# Altium schematic sheet Remie_Schematic.SchDoc (part 1 of 3)
size A2; SheetNumber: 1; SheetTotal: 1
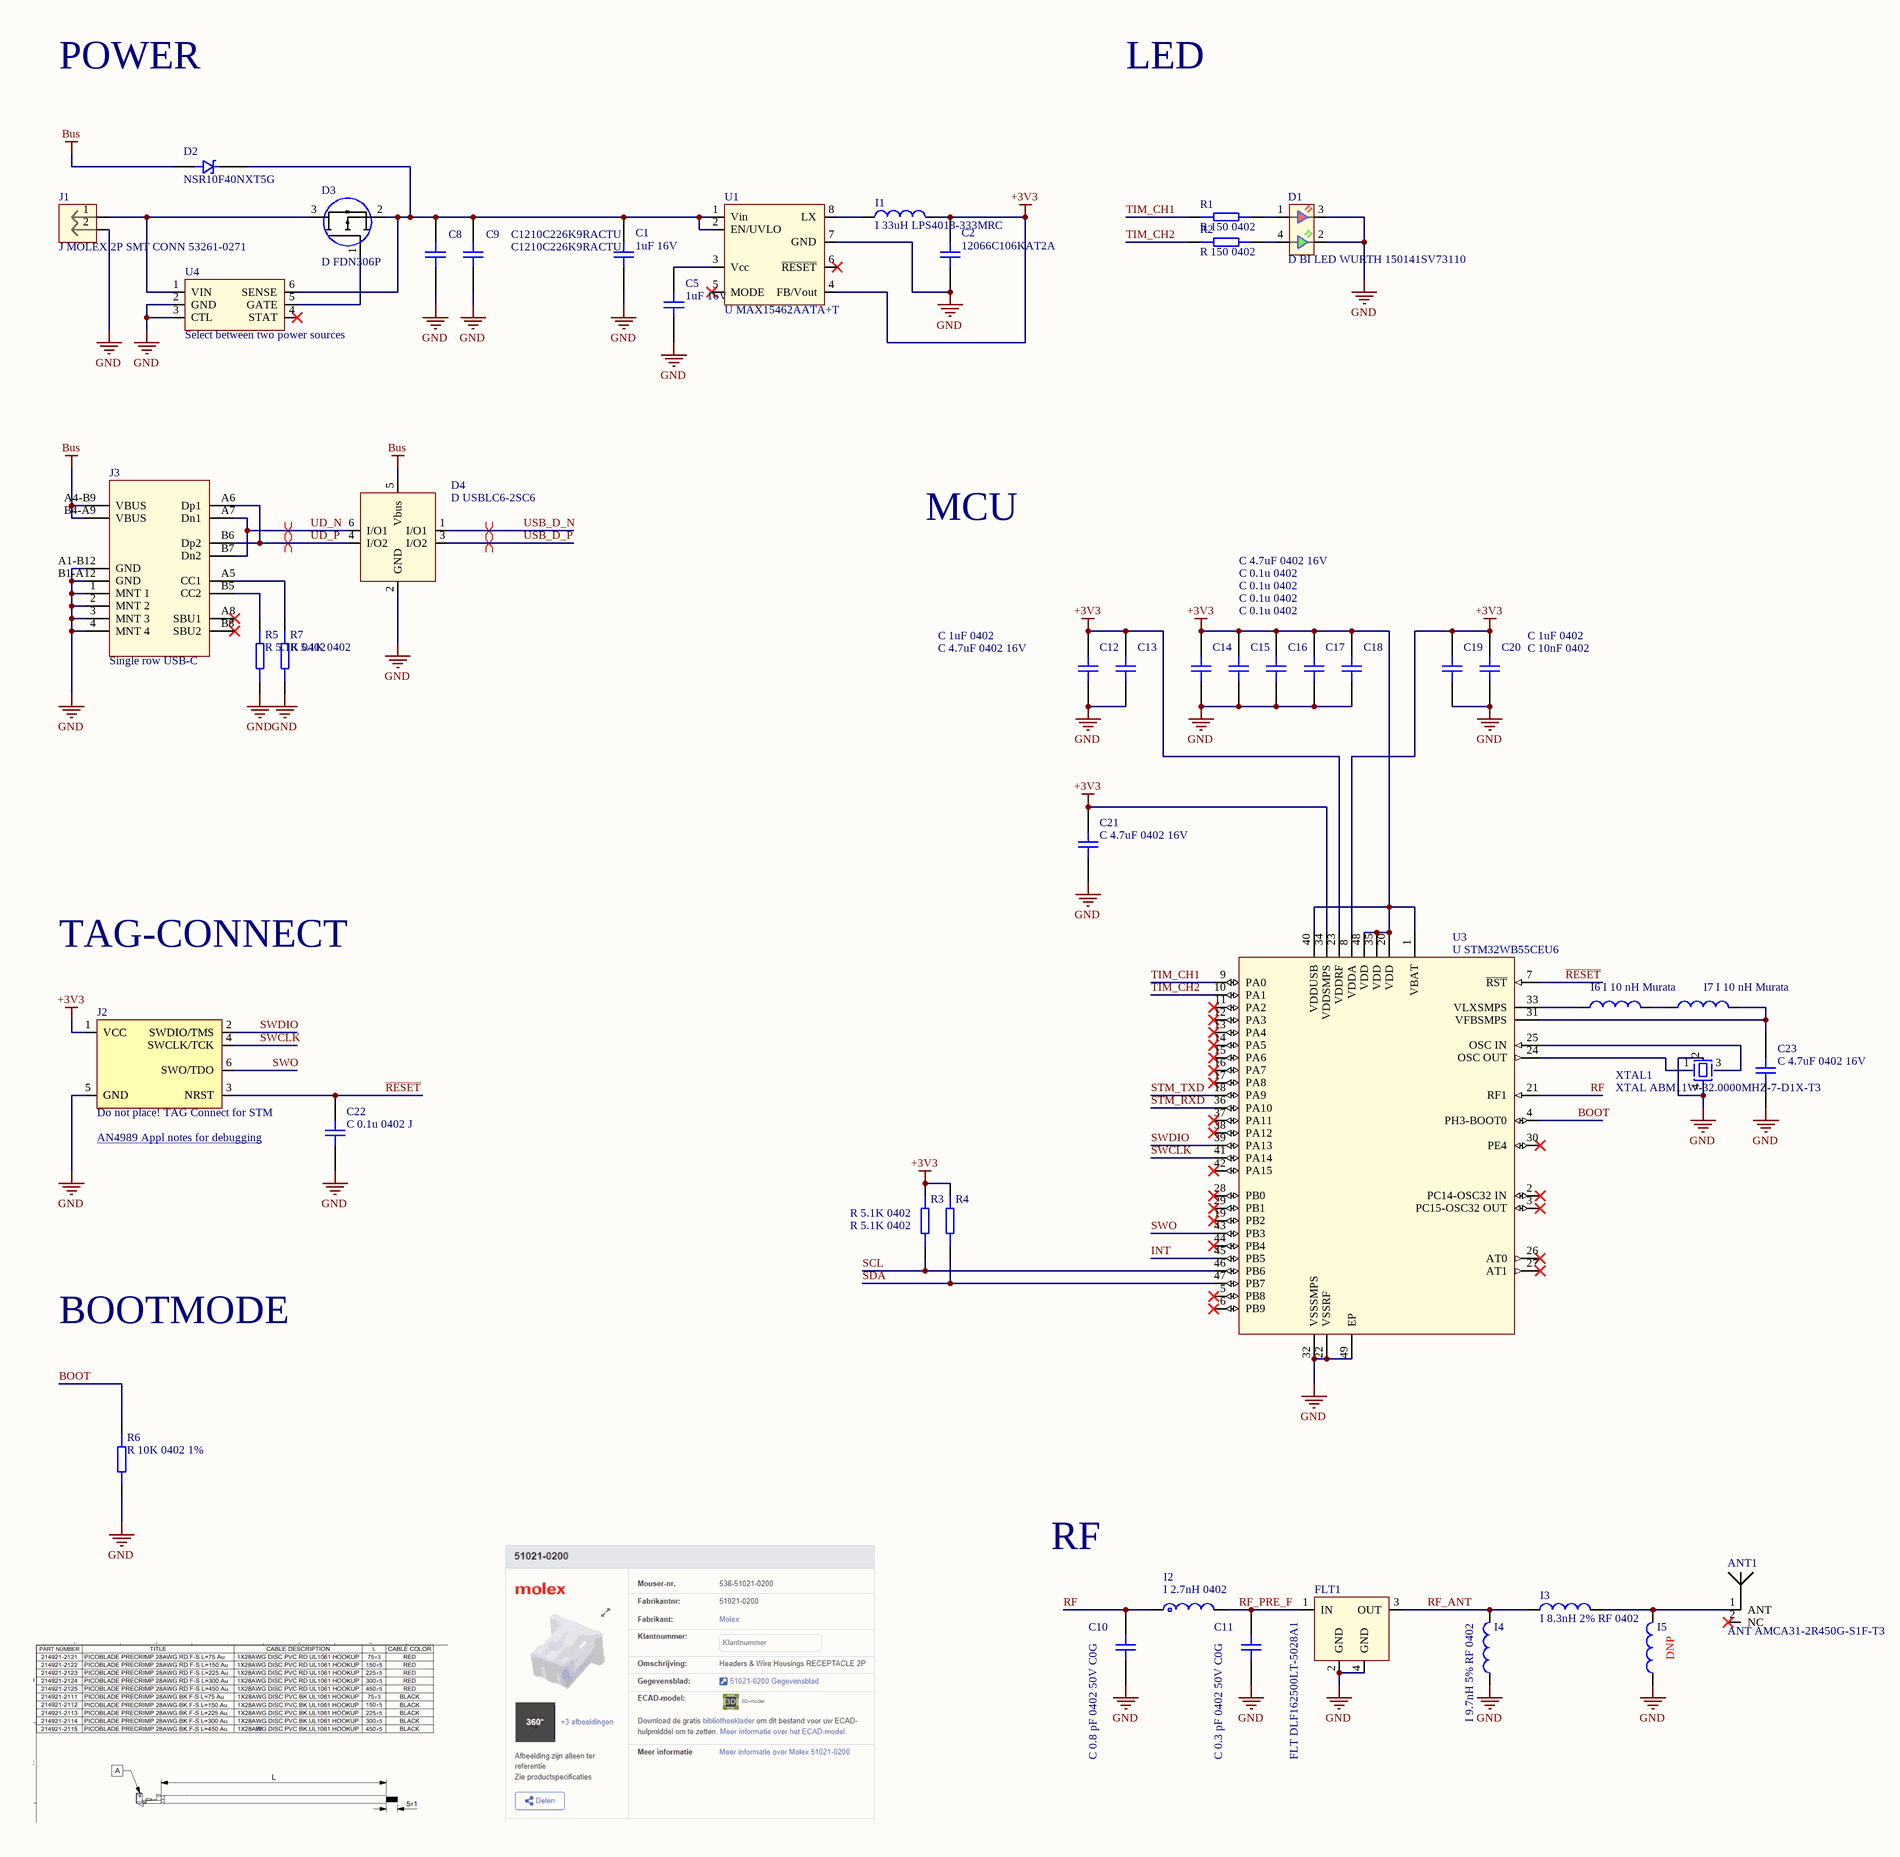
[diagram p0: Remie_Schematic.SchDoc, left]
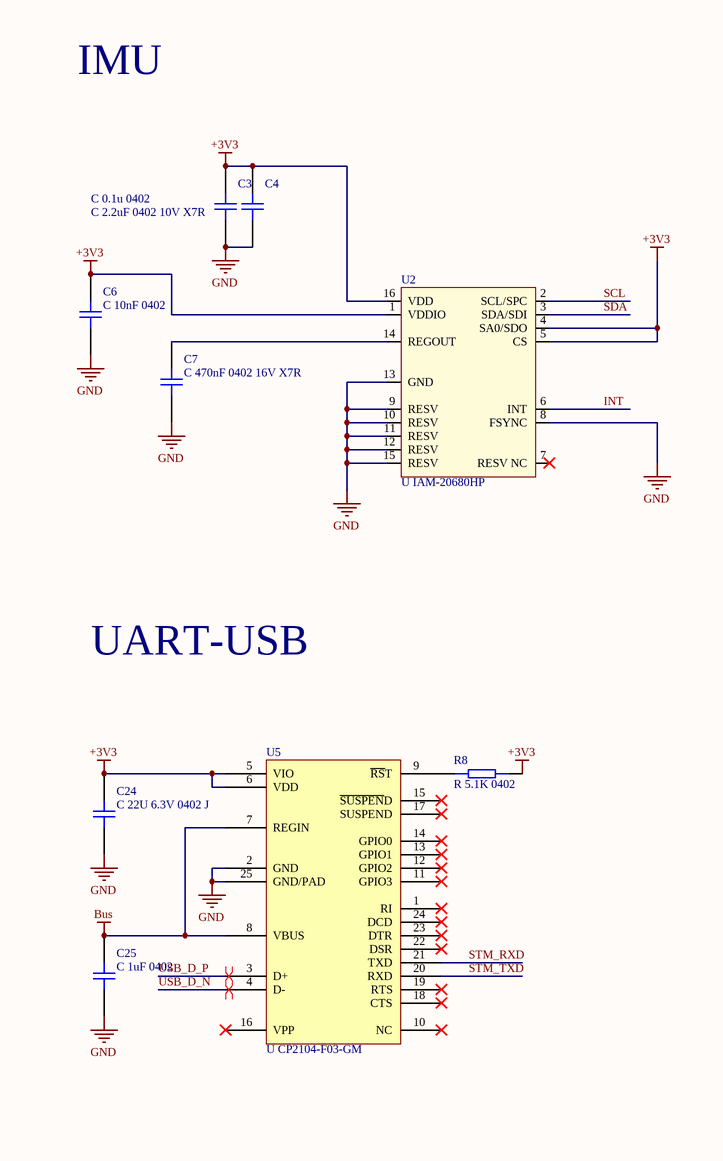
[diagram p1: Remie_Schematic.SchDoc, right]

## Parts
ANT1  ANT AMCA31-2R450G-S1F-T3  [ABRACON AMCA31]
C1  1uF 16V  [C0805]
C2  12066C106KAT2A  [C1206]
C3  C 0.1u 0402  [C0402]
C4  C 2.2uF 0402 10V X7R  [C0402]
C5  1uF 16V  [C0805]
C6  C 10nF 0402  [C0402]
C7  C 470nF 0402 16V X7R  [C0402]
C8  C1210C226K9RACTU  [C1210]
C9  C1210C226K9RACTU  [C1210]
C10  C 0.8 pF 0402 50V C0G  [C0402]
C11  C 0.3 pF 0402 50V C0G  [C0402]
C12  C 1uF 0402  [C0402]
C13  C 4.7uF 0402 16V  [C0402]
C14  C 4.7uF 0402 16V  [C0402]
C15  C 0.1u 0402  [C0402]
C16  C 0.1u 0402  [C0402]
C17  C 0.1u 0402  [C0402]
C18  C 0.1u 0402  [C0402]
C19  C 1uF 0402  [C0402]
C20  C 10nF 0402  [C0402]
C21  C 4.7uF 0402 16V  [C0402]
C22  C 0.1u 0402 J  [C0402]
C23  C 4.7uF 0402 16V  [C0402]
C24  C 22U 6.3V 0402 J  [C0402]
C25  C 1uF 0402  [C0402]
D1  D BI LED WURTH 150141SV73110  [Wurth 150141SV73110]
D2  NSR10F40NXT5G  [SCHOTTKY NSR10]
D3  D FDN306P  [SOT23]
D4  D USBLC6-2SC6  [SOT23-6L]
FLT1  FLT DLF162500LT-5028A1  [TDK DLF Series]
I1  I 33uH LPS4018-333MRC  [COILCRAFT LPS4018]
I2  I 2.7nH 0402  [I0402 POL]
I3  I 8.3nH 2% RF 0402  [R0402]
I4  I 9.7nH 5% RF 0402  [R0402]
I5  I 9.7nH 5% RF 0402  [R0402]  (value not drawn)  (no BOM)
I6  I 10 nH Murata  [MURATA LQG15XXX IND]
I7  I 10 nH Murata  [MURATA LQG15XXX IND]
J1  J MOLEX 2P SMT CONN 53261-0271  [MOLEX 532610271]
J2  Do not place! TAG Connect for STM  [TAG-CONNECT-6]  (no BOM)
J3  Single row USB-C  [FP-USB4105-GF-A-MFG]
R1  R 150 0402  [R0402]
R2  R 150 0402  [R0402]
R3  R 5.1K 0402  [R0402]
R4  R 5.1K 0402  [R0402]
R5  R 5.1K 0402  [R0402]
R6  R 10K 0402 1%  [R0402]
R7  R 5.1K 0402  [R0402]
R8  R 5.1K 0402  [R0402]
U1  U MAX15462AATA+T  [8TDFN-CU]
U2  U IAM-20680HP  [IAM-20680HP]
U3  U STM32WB55CEU6  [STM32WB55xx VFQFPN58]
U4  Select between two power sources  [TSOT-23]
U5  U CP2104-F03-GM  [QFN24-CP2104]
XTAL1  XTAL ABM11W-32.0000MHZ-7-D1X-T3  [ABRACON ABM11W CRYSTALS]

## Nets
+3V3: C2.2 C3.2 C4.2 C6.2 C12.2 C13.2 C14.2 C15.2 C16.2 C17.2 C18.2 C19.2 C20.2 C21.2 C24.2 I1.2 J2.1(VCC) R3.2 R4.2 R8.2 U1.4(FB/Vout) U2.1(VDDIO) U2.4(SA0/SDO) U2.5(CS) U2.16(VDD) U3.1(VBAT) U3.8(VDDA) U3.20(VDD) U3.23(VDDRF) U3.34(VDDSMPS) U3.35(VDD) U3.40(VDDUSB) U3.48(VDD) U5.5(VIO) U5.6(VDD)
Bus: C25.2 D2.A D4.5(Vbus) J3.A4-B9(VBUS) J3.B4-A9(VBUS) U5.7(REGIN) U5.8(VBUS)
GND: C1.1 C2.1 C3.1 C4.1 C5.1 C6.1 C7.1 C8.1 C9.1 C10.1 C11.1 C12.1 C13.1 C14.1 C15.1 C16.1 C17.1 C18.1 C19.1 C20.1 C21.1 C22.1 C23.1 C24.1 C25.1 D1.2 D1.3 D4.2(GND) FLT1.2(GND) FLT1.4(GND) I4.1 I5.1 J1.2 J2.5(GND) J3.1(MNT_1) J3.2(MNT_2) J3.3(MNT_3) J3.4(MNT_4) J3.A1-B12(GND) J3.B1-A12(GND) R5.1 R6.1 R7.1 U1.7(GND) U2.8(FSYNC) U2.9(RESV) U2.10(RESV) U2.11(RESV) U2.12(RESV) U2.13(GND) U2.15(RESV) U3.22(VSSRF) U3.32(VSSSMPS) U3.49(EP) U4.2(GND) U4.3(CTL) U5.2(GND) U5.25(GND/PAD) XTAL1.2 XTAL1.4
~{RESET}: C22.2 J2.3(NRST) U3.7(~{RST})
BOOT: R6.2 U3.4(PH3-BOOT0)
INT: U2.6(INT) U3.45(PB5)
RF: C10.2 I2.1 U3.21(RF1)
RF_ANT: FLT1.3(OUT) I3.1 I4.2
RF_PRE_F: C11.2 FLT1.1(IN) I2.2
SCL: R3.1 U2.2(SCL/SPC) U3.46(PB6)
SDA: R4.1 U2.3(SDA/SDI) U3.47(PB7)
STM_RXD: U3.36(PA10) U5.21(TXD)
STM_TXD: U3.18(PA9) U5.20(RXD)
SWCLK: J2.4(SWCLK/TCK) U3.41(PA14)
SWDIO: J2.2(SWDIO/TMS) U3.39(PA13)
SWO: J2.6(SWO/TDO) U3.43(PB3)
TIM_CH1: R1.1 U3.9(PA0)
TIM_CH2: R2.1 U3.10(PA1)
UD_N: D4.6(I/O1) J3.A7(Dn1) J3.B7(Dn2)
UD_P: D4.4(I/O2) J3.A6(Dp1) J3.B6(Dp2)
USB_D_N: D4.1(I/O1) U5.4(D-)
USB_D_P: D4.3(I/O2) U5.3(D+)
NetANT1_1: ANT1.1(ANT) I3.2 I5.2
NetC1_2: C1.2 C8.2 C9.2 D2.K D3.2(S) U1.1(Vin) U1.2(EN/UVLO) U4.6(SENSE)
NetC5_2: C5.2 U1.3(Vcc)
NetC7_2: C7.2 U2.14(REGOUT)
NetC23_2: C23.2 I7.2 U3.31(VFBSMPS)
NetD1_1: D1.1 R1.2
NetD1_4: D1.4 R2.2
NetD3_1: D3.1(G) U4.5(GATE)
NetD3_3: D3.3(D) J1.1 U4.1(VIN)
NetI1_1: I1.1 U1.8(LX)
NetI6_1: I6.1 U3.33(VLXSMPS)
NetI6_2: I6.2 I7.1
NetJ3_A5: J3.A5(CC1) R7.2
NetJ3_B5: J3.B5(CC2) R5.2
NetR8_1: R8.1 U5.9(~{RS}T)
NetU3_24: U3.24(OSC_OUT) XTAL1.1
NetU3_25: U3.25(OSC_IN) XTAL1.3

Not connected (* = marked no-connect by the designer): ANT1 2(NC)*; J3 A8(SBU1)* B8(SBU2)*; U1 5(MODE)* 6(~{RESET})*; U2 7(RESV_NC)*; U3 2(PC14-OSC32_IN)* 3(PC15-OSC32_OUT)* 5(PB8)* 6(PB9)* 11(PA2)* 12(PA3)* 13(PA4)* 14(PA5)* 15(PA6)* 16(PA7)* 17(PA8)* 19(PB2)* 26(AT0)* 27(AT1)* 28(PB0)* 29(PB1)* 30(PE4)* 37(PA11)* 38(PA12)* 42(PA15)* 44(PB4)*; U4 4(STAT)*; U5 1(RI)* 10(NC)* 11(GPIO3)* 12(GPIO2)* 13(GPIO1)* 14(GPIO0)* 15(~{SUSPEN}D)* 16(VPP)* 17(SUSPEND)* 18(CTS)* 19(RTS)* 22(DSR)* 23(DTR)* 24(DCD)*

## Layout directives
differential pair: UD_N, UD_P, USB_D_N, USB_D_P

## Notes on the sheet
- POWER
- LED
- IMU
- MCU
- UART-USB
- TAG-CONNECT
- (near J2) AN4989 Appl notes for debugging <https://www.st.com/resource/en/application_note/an4989-stm32-microcontroller-debug-toolbox-stmicroelectronics.pdf>
- BOOTMODE
- RF
- (near I5) DNP